# EAGLE design Adafruit nRF52840 Bluefruit Feather Express Rev E (EAGLE 9.6.2)
COMPANY: ADAFRUIT INDUSTRIES; DRAWN: KTOWN; REV: D; YEAR: 2018
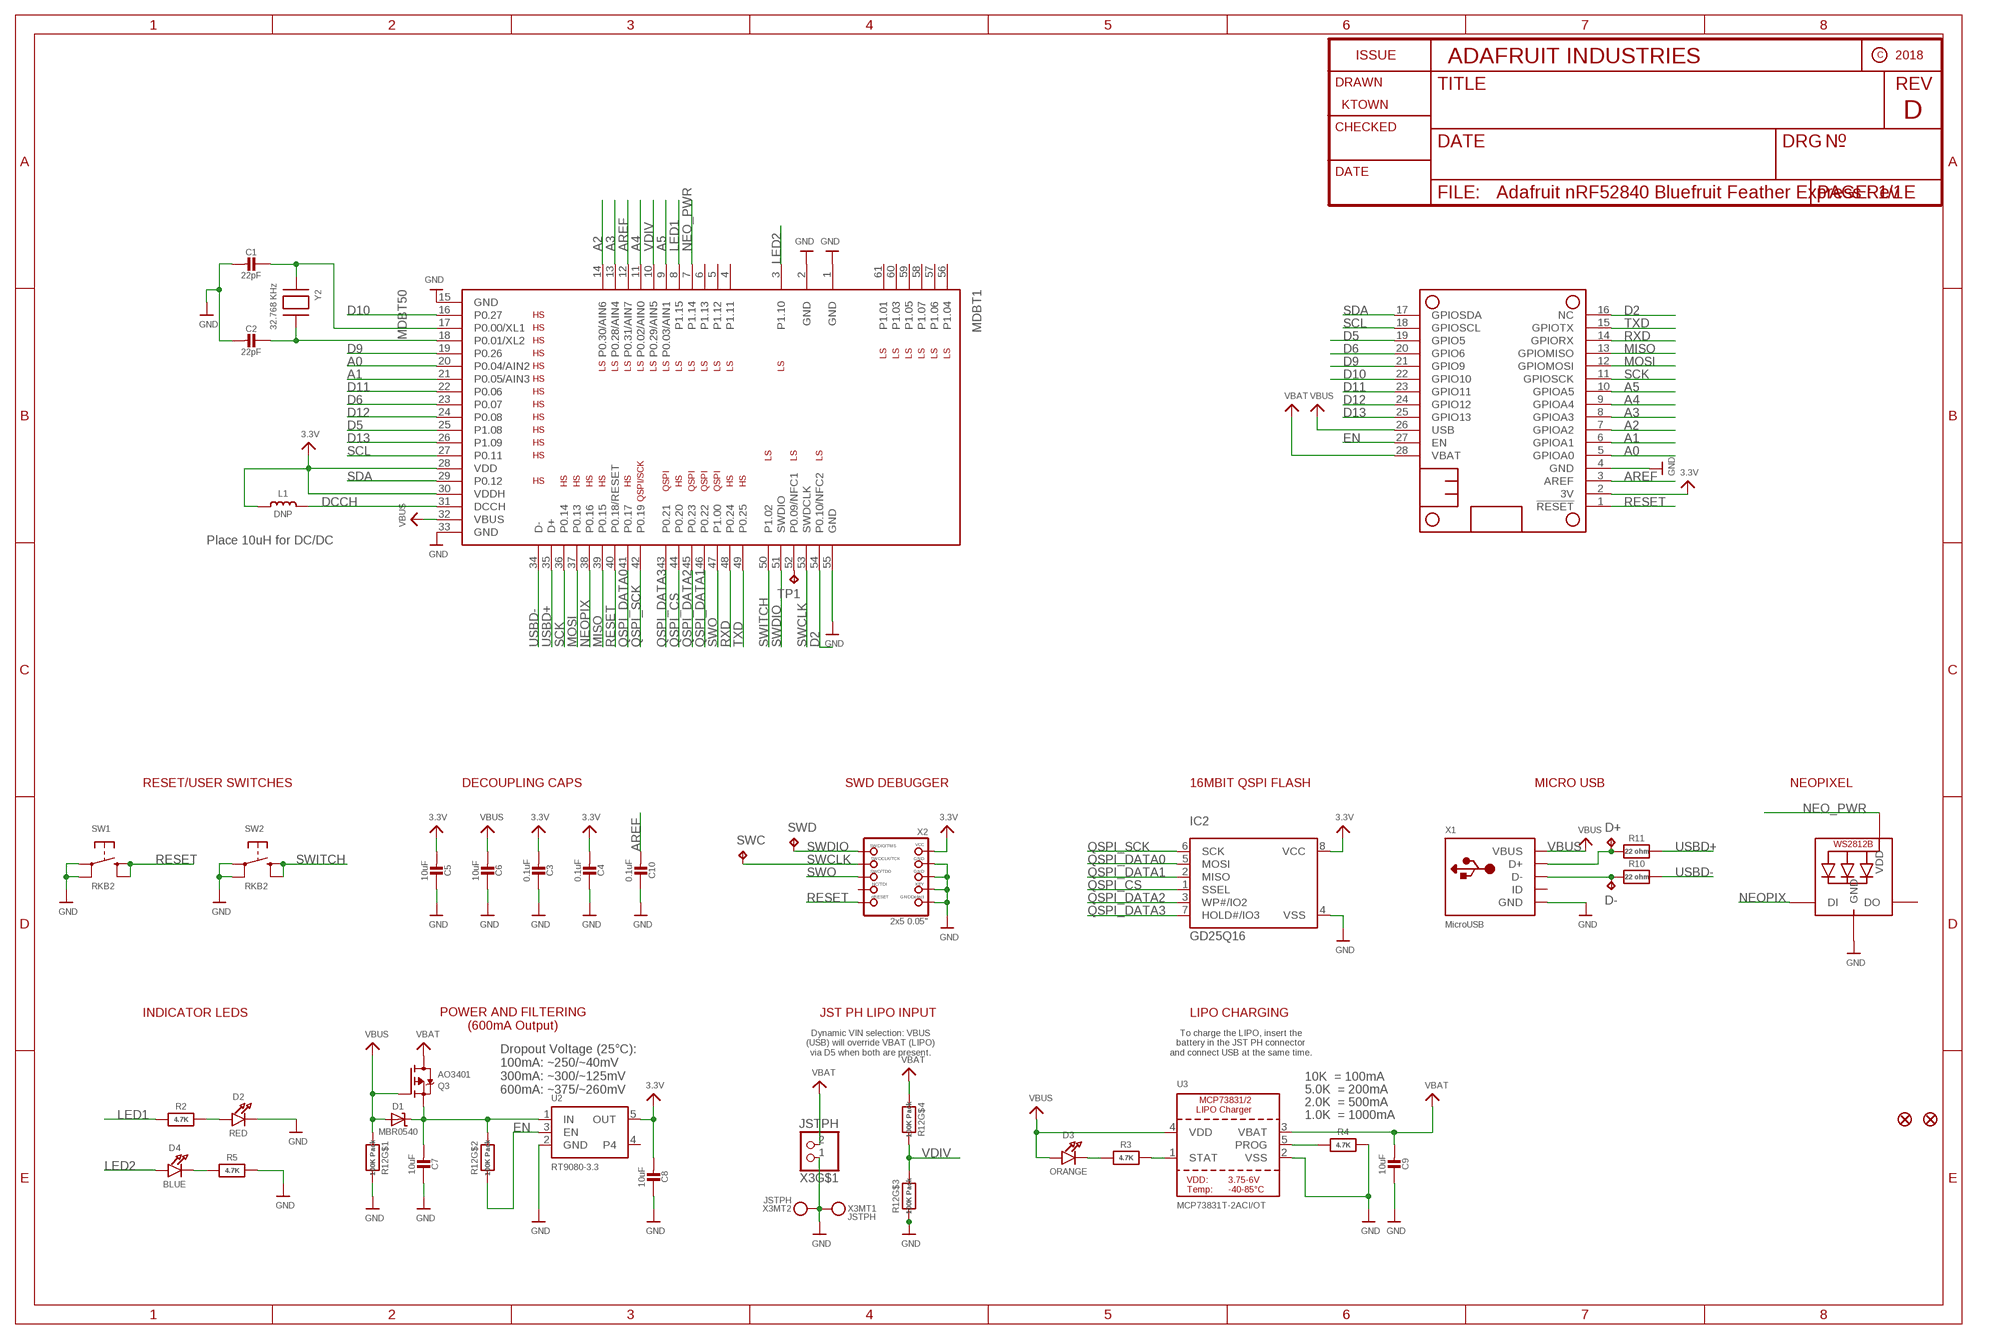
[diagram p0: schematic, sheet 1]

## Parts
C1  22pF  CAP_CERAMIC0603_NO  [0603-NO]
C2  22pF  CAP_CERAMIC0603_NO  [0603-NO]
C3  0.1uF  CAP_CERAMIC0603_NO  [0603-NO]
C4  0.1uF  CAP_CERAMIC0603_NO  [0603-NO]
C5  10uF  CAP_CERAMIC0805-NOOUTLINE  [0805-NO]
C6  10uF  CAP_CERAMIC0805-NOOUTLINE  [0805-NO]
C7  10uF  CAP_CERAMIC0805-NOOUTLINE  [0805-NO]
C8  10uF  CAP_CERAMIC0805-NOOUTLINE  [0805-NO]
C9  10uF  CAP_CERAMIC0805-NOOUTLINE  [0805-NO]
C10  0.1uF  CAP_CERAMIC0603_NO  [0603-NO]
D1  MBR0540  DIODE-SCHOTTKYSOD-123  [SOD-123]
D2  RED  LED0603_NOOUTLINE  [CHIPLED_0603_NOOUTLINE]
D3  ORANGE  LED0603_NOOUTLINE  [CHIPLED_0603_NOOUTLINE]
D4  BLUE  LED0603_NOOUTLINE  [CHIPLED_0603_NOOUTLINE]
D+  TPTP10R  [TP10R]
D-  TPTP10R  [TP10R]
FID1  FIDUCIAL_1MM  [FIDUCIAL_1MM]
FID2  FIDUCIAL_1MM  [FIDUCIAL_1MM]
IC2  GD25Q16  SPIFLASH_8PINUX  [USON8]
L1  DNP  INDUCTOR_0805MP  [_0805MP]
LED1  WS2812B_3535FULL  [LED3535_FULLPADS]
MDBT1  MDBT50  [MDBT50]
MS1  FEATHERWING_NODIM  [FEATHERWING_NODIM]
Q3  AO3401  MOSFET-P  [SOT23-R]
R2  4.7K  RESISTOR_0603_NOOUT  [0603-NO]
R3  4.7K  RESISTOR_0603_NOOUT  [0603-NO]
R4  4.7K  RESISTOR_0603_NOOUT  [0603-NO]
R5  4.7K  RESISTOR_0603_NOOUT  [0603-NO]
R10  22 ohm  RESISTOR_0603MP  [_0603MP]
R11  22 ohm  RESISTOR_0603MP  [_0603MP]
R12  100K Pack  RESISTOR_4PACK  [RESPACK_4X0603]
SW1  RKB2  SWITCH_TACT_SMT_RKB2  [BTN_RKB2_4.6X2.8]
SW2  RKB2  SWITCH_TACT_SMT_RKB2  [BTN_RKB2_4.6X2.8]
SWC  TPTP12R  [TP12R]
SWD  TPTP12R  [TP12R]
TP1  TPTP10R  [TP10R]
U2  RT9080-3.3  VREG_SOT23-5  [SOT23-5]
U3  MCP73831T-2ACI/OT  MCP73831/2  [SOT23-5]
X1  MicroUSB  USB_MICRO_20329_V2  [4UCONN_20329_V2]
X2  2x5 0.05"  JTAG-CORTEXBOXPOSTS  [2X05_1.27MM_BOX_POSTS]
X3  JSTPH  CON_JST_PH_2PIN_MT_BATT  [JSTPH2_BATT]
Y2  32.768 KHz  XTAL-3.2X1.5  [XTAL3215]

## Nets
3.3V [power]: C3.2 C4.2 C5.2 C8.2 IC2.8(VCC) L1.1 MDBT1.28(VDD) MDBT1.30(VDDH) MS1.2(3V) U2.5(OUT) X2.1(VCC)
A0: MDBT1.20(P0.04/AIN2) MS1.5(GPIOA0)
A1: MDBT1.21(P0.05/AIN3) MS1.6(GPIOA1)
A2: MDBT1.14(P0.30/AIN6) MS1.7(GPIOA2)
A3: MDBT1.13(P0.28/AIN4) MS1.8(GPIOA3)
A4: MDBT1.11(P0.02/AIN0) MS1.9(GPIOA4)
A5: MDBT1.9(P0.03/AIN1) MS1.10(GPIOA5)
AREF: C10.2 MDBT1.12(P0.31/AIN7) MS1.3(AREF)
D2: MDBT1.54(P0.10/NFC2) MS1.16(NC)
D5: MDBT1.25(P1.08) MS1.19(GPIO5)
D6: MDBT1.23(P0.07) MS1.20(GPIO6)
D9: MDBT1.19(P0.26) MS1.21(GPIO9)
D10: MDBT1.16(P0.27) MS1.22(GPIO10)
D11: MDBT1.22(P0.06) MS1.23(GPIO11)
D12: MDBT1.24(P0.08) MS1.24(GPIO12)
D13: MDBT1.26(P1.09) MS1.25(GPIO13)
D+: D+.TP R11.1 X1.D+
D-: D-.TP R10.1 X1.D-
DCCH: L1.2 MDBT1.31(DCCH)
EN: MS1.27(EN) R12.2 U2.3(EN)
GND: C1.2 C2.2 C3.1 C4.1 C5.1 C6.1 C7.1 C8.1 C9.1 C10.1 D2.C IC2.4(VSS) LED1.4(GND) MDBT1.1(GND) MDBT1.2(GND) MDBT1.15(GND) MDBT1.33(GND) MDBT1.55(GND) MS1.4(GND) R4.2 R5.2 R12.3 R12.8 SW1.A'(P1) SW1.A(P) SW2.A'(P1) SW2.A(P) U2.2(GND) U3.2(VSS) X1.BASE@1(GND) X1.BASE@2(GND) X1.GND X1.SPRT@1(GND) X1.SPRT@2(GND) X1.SPRT@3(GND) X1.SPRT@4(GND) X2.3(GND) X2.5(GND) X2.7(KEY) X2.9(GNDDETECT) X3.1 X3.NC1 X3.NC2
LED1: MDBT1.8(P1.15) R2.1
LED2: D4.A MDBT1.3(P1.10)
MISO: MDBT1.39(P0.15) MS1.13(GPIOMISO)
MOSI: MDBT1.37(P0.13) MS1.12(GPIOMOSI)
N$1: D3.C R3.1
N$5: D2.A R2.2
N$7: C1.1 MDBT1.17(P0.00/XL1) Y2.P$1
N$8: C2.1 MDBT1.18(P0.01/XL2) Y2.P$2
N$11: R3.2 U3.1(STAT)
N$12: R4.1 U3.5(PROG)
N$14: D4.C R5.1
NEO_PWR: LED1.2(VDD) MDBT1.7(P1.14)
NEOPIX: LED1.1(DI) MDBT1.38(P0.16)
NFC2: MDBT1.52(P0.09/NFC1) TP1.TP
QSPI_CS: IC2.1(SSEL) MDBT1.44(P0.20)
QSPI_DATA0: IC2.5(MOSI) MDBT1.41(P0.17)
QSPI_DATA1: IC2.2(MISO) MDBT1.46(P0.22)
QSPI_DATA2: IC2.3(WP#/IO2) MDBT1.45(P0.23)
QSPI_DATA3: IC2.7(HOLD#/IO3) MDBT1.43(P0.21)
QSPI_SCK: IC2.6(SCK) MDBT1.42(P0.19)
RESET: MDBT1.40(P0.18/RESET) MS1.1(!RESET) SW1.B'(S1) SW1.B(S) X2.10(NRESET)
RXD: MDBT1.48(P0.24) MS1.14(GPIORX)
SCK: MDBT1.36(P0.14) MS1.11(GPIOSCK)
SCL: MDBT1.27(P0.11) MS1.18(GPIOSCL)
SDA: MDBT1.29(P0.12) MS1.17(GPIOSDA)
SWCLK: MDBT1.53(SWDCLK) SWC.TP X2.4(SWDCLK)
SWDIO: MDBT1.51(SWDIO) SWD.TP X2.2(SWDIO)
SWITCH: MDBT1.50(P1.02) SW2.B'(S1) SW2.B(S)
SWO: MDBT1.47(P1.00) X2.6(SWO)
TXD: MDBT1.49(P0.25) MS1.15(GPIOTX)
USBD+: MDBT1.35(D+) R11.2
USBD-: MDBT1.34(D-) R10.2
VBAT [power]: C9.2 MS1.28(VBAT) Q3.3(D) R12.4 U3.3(VBAT) X3.2
VBUS [power]: C6.2 D1.A D3.A MDBT1.32(VBUS) MS1.26(USB) Q3.1(G) R12.1 U3.4(VDD) X1.VBUS
VDIV: MDBT1.10(P0.29/AIN5) R12.5 R12.6
VHI [power]: C7.2 D1.C Q3.2(S) R12.7 U2.1(IN)
Unconnected: LED1.3(DO) MDBT1.4(P1.11) MDBT1.5(P1.12) MDBT1.6(P1.13) MDBT1.56(P1.04) MDBT1.57(P1.06) MDBT1.58(P1.07) MDBT1.59(P1.05) MDBT1.60(P1.03) MDBT1.61(P1.01) U2.4 X1.ID X2.8(TDI)

## Notes on the sheet
- Place 10uH for DC/DC
- RESET/USER SWITCHES | DECOUPLING CAPS | SWD DEBUGGER | 16MBIT QSPI FLASH | MICRO USB | NEOPIXEL
- INDICATOR LEDS | JST PH LIPO INPUT | LIPO CHARGING
- POWER AND FILTERING
  (600mA Output)
- Dynamic VIN selection: VBUS
  (USB) will override VBAT (LIPO)
  via D5 when both are present.
- To charge the LIPO, insert the
  battery in the JST PH connector
  and connect USB at the same time.
- 10K  = 100mA
- Dropout Voltage (25°C):
  100mA: ~250/~40mV
  300mA: ~300/~125mV
  600mA: ~375/~260mV
- 5.0K  = 200mA
- 2.0K  = 500mA
- 1.0K  = 1000mA

## Library data of the parts
C1-C10 = microbuilder:CAP_CERAMIC: Ceramic Capacitors For new designs, use the packages preceded by an '_' character since they are more reliable: The following footprints should be used on most boards: _0402 - Standard footprint for regular board layouts _0603 - Standard footprint for regular board layouts _0805 - Standard footprint for regular board layouts _1206 - Standard footprint for regular board layouts For extremely tight-pitch boards where space is at a premium, the following 'micro-pitch' footprints can be used (smaller pads, no silkscreen outline, etc.): _0402MP - Micro-pitch footprint for very dense/compact boards _0603MP - Micro-pitch footprint for very dense/compact boards _0805MP - Micro-pitch footprint for very dense/compact boards _1206MP - Micro-pitch footprint for very dense/compact boards
D1 = microbuilder:DIODE-SCHOTTKY
D2-D4 = microbuilder:LED: LED 0603 - 0603 Surface Mount Package 2mA: Green LED - Low Power (3.9mcd, 2ma, 1.7Vf) - Digikey: 475-2709-2-ND Orange LED - Low Power (9.8mcd, 2ma, 1.8Vf) - Digikey: 475-1194-2-ND Red LED - Low Power (5mcd, 2ma, 1.8Vf) - Digikey: 475-1195-2-ND Yellow LED - Low Power (7mcd, 2ma, 1.8Vf) - Digikey: 475-1196-2-ND 5mA: Blue LED - Low Power (17mcd, 5ma, 2.9Vf) - Digikey: LNJ937W8CRACT-ND 0805 - 0805 Surface Mount Package 2mA: Red LED (8.8mcd, 2mA, 1.8Vf, Clear) - Low Power [Digikey: 475-2510-1-ND] Green LED (5mcd, 2mA, 1.8Vf, Clear) - Low Power [Digikey: 475-2730-1-ND] Yellow LED (11.3mcd, 2mA, 1.8Vf, Clear) - Low Power [Digikey: 475-2555-1-ND] 20mA: Red LED (104mcd, 20mA, Diffused) - LS R976 [Digikey: 475-1278-6-ND] Red LED (12mcd, 20mA, 2.0Vf, Clear) - APT2012EC [Digikey: 754-1128-1-ND] Green LED (15mcd, 20mA, 2.2Vf, Clear) - APT2012GC [Digikey: 754-1131-1-ND] Orange LED (160mcd, 20mA, 2.1Vf, Clear) - APT2012SECK [Digikey: 754-1130-1-ND] 1206 - 1206 Surface Mount Package Green LED (26mcd, 20mA, Diffused) - LG N971 [Digikey: 475-1407-6-ND] Red LED (15mcd, 20mA, Diffused) - LH N974 [Digikey: 475-1416-6-ND] Cree - Cree High-Power Surface Mount LEDs XPEBWT-L1-0000-00D50 - White 111lm 350mA 2.9Vf 6200K 110° XTEAWT-00-0000-00000LEE3 - White 114lm 350mA 2.85Vf 5000K 115° Everlight - Everlight 45-21 Series Surface Mount LEDs 45-21/QK2C-B2832AC2CB2/2T - Warm White 2000mcd 20mA 3.25Vf 3050K 120° 45-21/LK2C-B38452C4CB2/2T - Nuetral White 2000mcd 20mA 3.25Vf 4150K 120° 45-21/LK2C-B50634C6CB2/2T - Cold White 2200mcd 20mA 3.25Vf 5650K 120° PLCC2 Reverse Mount LS T77K-J1L2-1-0-2-R18-Z - Red 11.25mcd 2mA 1.8Vf 630nm 120° LO T77K-L1M2-24-Z - Orange 19.6mcd 2mA 1.8Vf 606nm 120° LY T77K-K2M1-26-Z - Yellow 15.7mcd 2mA 1.8Vf 587nm 120°; ROT: 270
D+ D- SWC SWD TP1 = testpad:TP: Test pad
FID1 FID2 = microbuilder:FIDUCIAL: Fiducial Alignment Points Various fiducial points for machine vision alignment.; BOM: EXCLUDE
IC2 = microbuilder:SPIFLASH_8PIN: SOIC8 SPI Flash Be careful with the size since SOIC8 flash comes in several 'widths' SOIC8 150 mil M25P16 - 16Mbit (2Mbit x 8) Serial Flash (75MHz SPI Bus), Supply: 2.7-3.6V Digikey: SOIC8 - M25P16-VMN6P-ND SOIC8 208 mil W25Q16BVSSIG - 16Mbit (2Mbit x 8) Serial Flash (104MHz SPI Bus), Supply: 2.7-3.6V Digikey: SOIC8 - W25Q16BVSSIG-ND
L1 = microbuilder:INDUCTOR: Inductors 0603: 10nH Ceramic Inductor - microwire antenna/RF (Digikey: 712-1434-2-ND) 0805: 560nH Ceramic Inductor - RF (Digikey: 553-1047-1-ND) 270nH Ceramic Inductor - Q = 40@250MHz, +-5%, 1 Ohm DC Resistance (Digikey: 535-10506-2-ND) 1007 (2518 Metric) SMT: 10µH 10% 250mOhm 820mA 1007 Inductor (Digikey: 587-2189-1-ND) 22µH 10% 500mOhm 580mA 1007 Inductor (Digikey: 587-2190-1-ND) 47µH 10% 950mOhm 420mA 1007 Inductor (Digikey: 587-2191-1-ND) 47µH 5% 100mOhm 1A 1008 Inductor (Digikey: 732-1816-1-ND) 5.0x5.0mm (Taiyo Yuden NR5040 Series) 6.8µH 20% 2.3A 64mOhm Inductor (Digikey: 587-2374-2-ND) 5.0x5.0mm (TDK VLC5045 Series) 4.7µH 20% 3.3A 34mOhm Inductor (Digikey: 445-6526-1-ND) 6.8µH 20% 2.7A 46mOhm Inductor (Digikey: 445-6527-1-ND) 6.0x6.0mm (TDK VLC6045 Series) 4.7µH 20% 3.8A 27mOhm Inductor (Digikey: 445-6538-2-ND) 6.8µH 20% 3A 41mOhm Inductor (Digikey: 445-6540-1-ND) 6.2µH 30% 2.2A 45mOhm Inductor (Digikey: SRR5028-6R2YCT-ND) - Not TDK VLC6045 but footprint should match 6.0x6.0mm (TDK SLF6045 Series) 6.8uH 30% 2A 33mOhm Inductor (Digikey: 445-4572-1-ND, Mouser: 810-SLF645T6R8N2R0PF) 6.0x6.0mm (Sumida CDRH5D28 Series) 6.2uH 30% 1.8A 45mOhm Inductor (Digikey: 308-1542-1-ND) Taiyo Yuden NR3015T2R2M - 2.2uH 20% 1.5A (Digikey: 587-1648-2-ND, Mouser: 963-NR3015T2R2M) - Used with TI TPS62172 CoilCraft RFID Transponder Coil - MA5532-AE (For use with AS3935 Lightning Sensor) Taiyo Yuden NRH2412T2R2MNGH - 2.2uH 20% 1AA (Digikey: 587-3443-1-ND) - Used with TI LM3671 Vishay IHLP 1.0uH Molded Inductor - 24mOhm DCR, 5A, +/-20%, -55°C-125°C (Digikey: 541-1319-1-ND)
LED1 = microbuilder:WS2812B; ROT: 180
MDBT1 = microbuilder:MDBT50: Raytac Corporation MDBT50 Bluetooth Low Energy Module based on Noridc nRF52840 Source: Raytac datasheet
MS1 = microbuilder:FEATHERWING
Q3 = microbuilder:MOSFET-P: P-Channel Mosfet LEGEND VDS: Voltage Drain-Source ID: Drain Current RDS(ON): Drain-Source On-State Resistance VGS(TH): Gate-Source Threshold Voltage CISS: Drain-Source Input Capacitance SOT-23 Name VDS ID RDS(ON) VGS(TH) CISS Order Number IRLML5103 30V 760mA 600 mOhm -- 75pF @ 25V Digikey: IRLML5103PBFCT-ND IRLML6401 12V 4.3A 50 mOhm 950mV @ 250µA 830pF @ 10V Digikey: IRLML6401PBFTR-ND NTR0202PL 20V 400mA 800 mOhm 2.3V @ 250uA 70pF @ 5V Digikey: NTR0202PLT1GOSTR-ND NTR4101PT1G 20V 1.8A 85 mOhm 1.2V @ 250uA 675pF @ 10V Digikey: NTR4101PT1GOSCT-ND DMP2004K 20V 600mA 900 mOhm 1V @ 250uA 175pF @ 16V Digikey: DMP2004KDICT-ND PMV65XP 20V 3.9A 76 mOhm 950mV @ 1mA 725pF @ 20V Digikey: 568-2358-2-ND TO-252 Name VDS ID RDS(ON) VGS(TH) CISS Order Number AOD417 30V 25A 34 mOhm 3V @ 250µA 920pF @ 15V Digikey: 785-1106-2-ND PowerPak Name VDS ID RDS(ON) VGS(TH) CISS Order Number AON7401 30V 12A 14 mOhm 3V @ 250µA 2600pF @ 15V Digikey: 785-1302-1-ND
R2-R5 R10 R11 = microbuilder:RESISTOR: Resistors For new designs, use the packages preceded by an '_' character since they are more reliable: The following footprints should be used on most boards: _0402 - Standard footprint for regular board layouts _0603 - Standard footprint for regular board layouts _0805 - Standard footprint for regular board layouts _1206 - Standard footprint for regular board layouts For extremely tight-pitch boards where space is at a premium, the following 'micro-pitch' footprints can be used (smaller pads, no silkscreen outline, etc.): _0402MP - Micro-pitch footprint for very dense/compact boards _0603MP - Micro-pitch footprint for very dense/compact boards _0805MP - Micro-pitch footprint for very dense/compact boards _1206MP - Micro-pitch footprint for very dense/compact boards
R12 = microbuilder:RESISTOR_4PACK: Resistor Packs (4 resistors) 4 x 0603 10K 1/16W - Digikey: YC164J-10KCT-ND
SW1 SW2 = adafruit_electromech:SWITCH_TACT_SMT: SMT Tact Switches RKB2 https://www.digikey.com/short/m027prz5
U2 = adafruit_power:VREG_SOT23-5: SOT23-5 Fixed Voltage Regulators Part Current Out V Out V In V Dropout θJA (°C/W) TJ (°C) Digikey Part No. ADP121 150mA 3.3V 3.4-5.5V 0.09V @ 150mA -- -- ADP121-AUJZ33R7CT-ND ADP121 150mA 3.0V 3.1-5.5V 0.09V @ 150mA -- -- ADP121-AUJZ30R7CT-ND ADP122 300mA 3.3V 3.4-5.5V 0.085V @ 300mA -- -- ADP122AUJZ-3.3-R7CT-ND ADP1712 300mA 3.3V 3.5-5.5V 0.17V @ 300mA -- -- ADP1712AUJZ-3.3-R7TR-ND AP7311 (Low Cost) 150mA 3.3V 3.5-6V 0.15V @ 150mA -- -- AP7311-33WG-7DICT-ND LD39015M18R 150mA 1.8V 1.9V-5.5V 0.08V @ 100mA -- -- 497-6977-1-ND LP2985A-33DBVR 150mA 3.3V 3.3-16V 0.28V @ 150mA 206 150 296-18479-1-ND MCP1824T-3302E/OT 300mA 3.3V 3.5V-6V 0.2V @ 300mA -- -- MCP1824T-3302E/OTCT-ND MIC5205-2.5YM5 TR 150mA 2.5V 2.7-16V 0.165V @ 150mA -- -- 576-1257-2-ND MIC5205-3.0YM5 TR 150mA 3.0V 3.2V-16V 0.165V @ 150mA -- -- 576-1258-2-ND MIC5205-3.3YM5 TR 150mA 3.3V 3.5V-16V 0.165V @ 150mA -- -- 576-1259-2-ND TPS780330220 150mA 3.3V+2.2V 3.6-5.5V 250mV Max -- -- 296-23332-1-ND TDA3663/N1,135 100mA 3.3V 3.5-45V 0.18V @ 50mA -- -- 568-5343-1-ND Max operating temp can be calculated using θJA, TJ (max junction temperature), and power in watts. Set the "Maximum Ambient Temperature" until it reaches TJ ("Max Junction Temperature"), which is the absolute limit for safe use of the regulator: Heat Sink Temperature Calculator <http://www.daycounter.com/Calculators/Heat-Sink-Temperature-Calculator.phtml> For example, With 12V source into a 3.3V LP2985 and a 30mA load, we are dissipating (12V-3.3V) * 0.03A = 0.261W. With a θJA of 206 °C/W, a TJ of 150°C, and 261mW we can safely use the chip without a heat sink up to 75°C (=147.1°C Junction Temperature).; JLC_ROTATION: 0
U3 = microbuilder:MCP73831/2: MCP73831/2 LIPO Charger VDD: 3.75 - 6V Temp -40 - 85°C Programmable Charge Rate: 15-500mA NOTE: STAT is a tri-state logic output on the MCP73831 and an open-drain output on the MCP73832. SOT23-5 with 4.2V output and tri-state logic on STAT = MCP73831T-2ACI/OT; JLC_ROTATION: 0; LCSC: C424093
X1 = adafruit_electromech:USB: USB Connectors USBMINIB - Surface Mount Female Mini-B USB Connector 4UConnector: 06564
X2 = adafruit_electromech:JTAG-CORTEX: Serial Wire (SW-DP) Connector Standard 0.05" 10-pin connector is for use with the Cortex M and Cortex A SWD (serial wire debugger) interface (SW-DP) Connectors 2x05_1.27MM_SMT - Inexpensive surface-mount header with bare pins, compatible with standard 10-pin SWD cables (4UCON: 16846) 2x05_1.27MM_BOX_NOPOSTS - Polarised surface-mount box (4UCON with caps: 19735, without caps: 15117 2x05_1.27MM_BOX_POSTS - Polarised surface-mount box with mounting holes (4UCON: 20317) Pinout: http://infocenter.arm.com/help/topic/com.arm.doc.faqs/attached/13634/cortex_debug_connectors.pdf http://www.keil.com/peripherals/coresight/connectors.asp
X3 = adafruit_electromech:CON_JST_PH_2PIN_MT; LCSC: C47647
Y2 = adafruit2:XTAL: Low cost SMT crystals, no capacitors included http://www.ladyada.net/library/eagle

## Net classes
1 power: width 0.254 mm

## Board
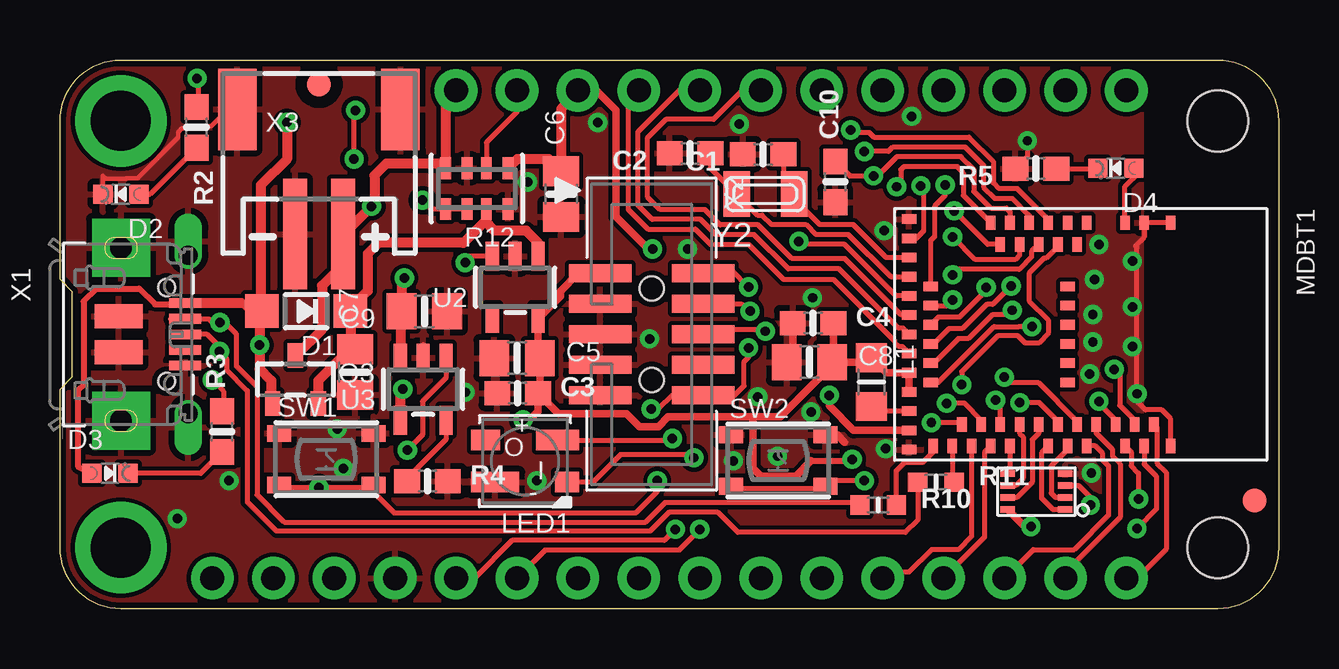
[diagram p1: board, top side]
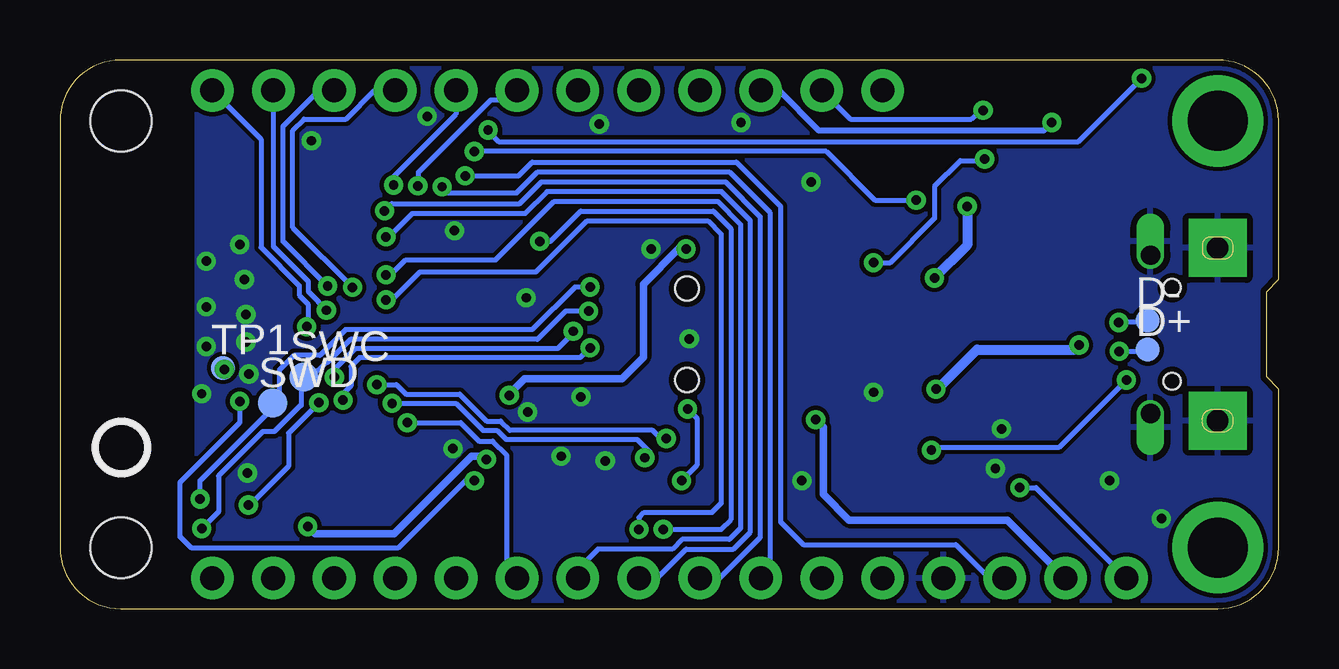
[diagram p2: board, bottom side, seen from below]

Size 50.8 x 22.86 mm. Coordinates in mm from the lower left corner, seen from the top.
Outline: 2.54,22.86 48.26,22.86 arc-90 50.8,20.32 50.8,2.54 arc-90 48.26,0 2.54,0 arc-90 0,2.54 0,9.14 0.51,9.65 0.51,13.21 0,13.72 0,20.32 arc-90 2.54,22.86
Copper layers (1*16): Top 0.035mm / dielectric 1.5mm / Bottom 0.035mm
Design rules "adafruit 7-7": minimum track width 7mil, minimum drill 15.5mil, track to track 7mil, track to pad 7mil, pad to pad 7mil, via to via 7mil, smd to smd 7mil, copper to edge 10mil, drill to drill 8mil, minimum pad ring 7mil, minimum via ring 8mil, stop-mask expansion 2mil, vias tented up to drill 20mil, thermal gap 10mil

### Footprints (pad centres in the part's own frame; a part is rotated, then mirrored left to right if it is on the bottom)
0603-NO = smd 1.075 x 1: 1 -0.85,0; 2 0.85,0
0805-NO = smd 1.24 x 1.5: 1 -0.95,0; 2 0.95,0
SOD-123 = smd 1.4 x 1.4: A 1.85,0; C -1.85,0
CHIPLED_0603_NOOUTLINE = smd 0.8 x 0.8: A 0,-0.75; C 0,0.75
TP10R = smd 1 x 1: TP 0,0
FIDUCIAL_1MM = smd 1 x 1: 1 0,0
USON8 = smd 0.6 x 0.275: 1 -1.2,0.75; 2 -1.2,0.25; 3 -1.2,-0.25; 4 -1.2,-0.75; 5 1.2,-0.75; 6 1.2,-0.25; 7 1.2,0.25; 8 1.2,0.75
_0805MP = smd 1.2 x 1.3: 1 -1.016,0; 2 1.016,0
LED3535_FULLPADS = smd 1 x 0.85: 1 -1.75,0.875 | smd 1.8 x 0.85: 2 -1.35,-0.875 | smd 1.2 x 0.85: 3 1.65,-0.875 | smd 2 x 0.85: 4 1.25,0.875
MDBT50 = smd 0.6 x 0.4: 1 -4.65,3.75; 2 -4.65,2.65; 3 -4.65,1.85; 4 -4.65,0.25; 5 -3.75,-0.15; 6 -4.65,-0.55; 7 -3.75,-0.95; 8 -4.65,-1.35; 9 -3.75,-1.75; 10 -4.65,-2.15; 11 -3.75,-2.55; 12 -4.65,-2.95; 13 -3.75,-3.35; 14 -4.65,-3.75; 34 4.65,-6.15; 35 4.65,-5.35; 36 3.75,-4.95; 37 4.65,-4.55; 38 3.75,-4.15; 39 4.65,-3.75; 40 3.75,-3.35; 41 4.65,-2.95; 42 3.75,-2.55; 43 3.75,-1.75; 44 4.65,-1.35; 45 3.75,-0.95; 46 4.65,-0.55; 47 3.75,-0.15; 48 4.65,0.25; 49 3.75,0.65; 50 3.75,1.45; 51 4.65,1.85; 52 3.75,2.25; 53 4.65,2.65; 54 3.75,3.05; 55 4.65,3.75 | smd 0.4 x 0.6: 15 -4.8,-7.15; 16 -4,-7.15; 17 -3.2,-7.15; 18 -2.4,-7.15; 19 -2,-6.25; 20 -1.6,-7.15; 21 -1.2,-6.25; 22 -0.8,-7.15; 23 -0.4,-6.25; 24 0,-7.15; 25 0.4,-6.25; 26 0.8,-7.15; 27 1.2,-6.25; 28 1.6,-7.15; 29 2,-6.25; 30 2.4,-7.15; 31 3.2,-7.15; 32 4,-7.15; 33 4.8,-7.15; 56 -2,-0.55; 57 -1.2,-0.55; 58 -0.4,-0.55; 59 0.4,-0.55; 60 1.2,-0.55; 61 2,-0.55
FEATHERWING_NODIM = drill 1 pad 1.778: 1 6.35,1.27; 2 8.89,1.27; 3 11.43,1.27; 4 13.97,1.27; 5 16.51,1.27; 6 19.05,1.27; 7 21.59,1.27; 8 24.13,1.27; 9 26.67,1.27; 10 29.21,1.27; 11 31.75,1.27; 12 34.29,1.27; 13 36.83,1.27; 14 39.37,1.27; 15 41.91,1.27; 16 44.45,1.27; 17 44.45,21.59; 18 41.91,21.59; 19 39.37,21.59; 20 36.83,21.59; 21 34.29,21.59; 22 31.75,21.59; 23 29.21,21.59; 24 26.67,21.59; 25 24.13,21.59; 26 21.59,21.59; 27 19.05,21.59; 28 16.51,21.59 | drill 2.5 pad 3.81: P$1 2.54,20.32; P$2 2.54,2.54 | hole 2.54: 48.26,20.32; 48.26,2.54
SOT23-R = smd 0.635 x 1.016: 1 -0.95,-1; 2 0.95,-1; 3 0,1
_0603MP = smd 0.8 x 0.8: 1 -0.762,0; 2 0.762,0
RESPACK_4X0603 = smd 0.45 x 0.9: 1 -1.3,-0.85; 2 -0.4,-0.85; 3 0.4,-0.85; 4 1.3,-0.85; 5 1.3,0.85; 6 0.4,0.85; 7 -0.4,0.85; 8 -1.3,0.85
BTN_RKB2_4.6X2.8 = smd 1 x 0.7: A 1.973,1.075; A' -1.973,1.075; B 1.973,-1.075; B' -1.973,-1.075
TP12R = smd 1.2 x 1.2: TP 0,0
SOT23-5 = smd 0.55 x 1.2: 1 -0.95,-1.3; 2 0,-1.3; 3 0.95,-1.3; 4 0.95,1.3; 5 -0.95,1.3
4UCONN_20329_V2 = smd 1 x 2: BASE@1 -0.75,-1.365; BASE@2 0.75,-1.365 | smd 0.4 x 1.35: D+ 0,1.41; D- -0.65,1.41; GND 1.3,1.41; ID 0.65,1.41; VBUS -1.3,1.41 | drill 0.8 pad 1.143 offset: SPRT@1 -3.3,1.535; SPRT@2 3.3,1.535 | drill 0.9 pad 2.413 square: SPRT@3 -3.6,-1.265; SPRT@4 3.6,-1.265 | hole 0.7: -1.95,0.635; 1.95,0.635
2X05_1.27MM_BOX_POSTS = smd 0.76 x 2.6: 1 -2.54,-2.15; 2 -2.54,2.15; 3 -1.27,-2.15; 4 -1.27,2.15; 5 0,-2.15; 6 0,2.15; 7 1.27,-2.15; 8 1.27,2.15; 9 2.54,-2.15; 10 2.54,2.15 | hole 1: -1.905,0; 1.905,0
JSTPH2_BATT = smd 1 x 4.6: 1 -1,-2.303; 2 1,-2.303 | smd 1.6 x 3.4: NC1 -3.4,2.897; NC2 3.4,2.897
XTAL3215 = smd 1.1 x 1.9: P$1 1.2,0; P$2 -1.2,0

### Placement (x,y rotation side)
C1  29.31,18.94 180 top
C2  26.26,18.97 180 top
C3  19.08,8.98 0 top
C4  31.39,11.9 0 top
C5  19.05,10.44 0 top
C6  20.89,17.27 90 top
C7  12.29,9.86 90 top
C8  31.24,10.27 0 top
C9  15.19,12.38 180 top
C10  32.32,17.78 90 top
D1  10.26,12.4 180 top
D2  2.54,17.27 90 top
D3  2.08,5.64 270 top
D4  44.01,18.35 90 top
D+  5.46,10.79 0 bottom
D-  5.46,12 0 bottom
FID1  10.79,21.84 0 top
FID2  49.78,4.51 0 top
IC2  40.7,4.88 180 top
L1  33.82,9.44 270 top
LED1  19.39,6.15 180 top
MDBT1  42.55,11.43 270 top
MS1  0,0 0 top
Q3  9.82,9.55 0 top
R2  5.69,20.05 270 top
R3  6.76,7.38 90 top
R4  15.32,5.31 0 top
R5  40.68,18.34 180 top
R10  34.1,4.32 0 top
R11  36.51,5.27 0 top
R12  17.37,17.5 180 top
SW1  11.1,6.22 0 top
SW2  29.93,6.17 0 top
SWC  40.63,9.65 0 bottom
SWD  41.94,8.56 0 bottom
TP1  44.01,10.03 0 bottom
U2  18.97,13.39 180 top
U3  15.14,9.14 180 top
U$10  [PCBFEAT-REV-056]  48.24,6.72 0 bottom
U$12  [NRF52840_BOT]  50.8,0 0 bottom
U$14  [NRF52840_TOP]  0,0 0 top
X1  3.81,11.43 270 top
X2  24.66,11.43 270 top
X3  10.79,17.91 0 top
Y2  29.4,17.27 0 top

### Tracks (layer width: path | path; a pad name or v marks a point on that pad's centre or on a via)
3.3V  (via drill 0.39)
  Top 0.254: 31.31,6.16 32.96,6.16 v33.02,6.22
  Top 0.305: 20.24,10.68 19.92,11 U2.5 20.86,13.02 20.86,13.23 21.6,13.97 X2.1 | MDBT1.30 MDBT1.28 34.44,9.83 L1.1 33.64,10.27 C8.2 | C8.2 32.24,10.33 C4.2 | C8.2 32.19,10.16 30.04,8 28.89,8 | 31.31,6.16 30.67,5.52 29.21,5.52 28.89,5.84 28.89,8 | IC2.8 40.21,3.42 v40.47,3.42 | C5.2 20,9.05 C3.2 | C3.2 20.78,8.13 23.62,8.13 24.16,7.59 24.94,7.59 25.35,8 28.89,8 | C3.2 19.93,8.22 19.58,7.87 v19.3,7.87
  Top 0.406: 20.24,10.68 C5.2
  Bottom 0.305: v40.47,3.42 40.16,3.11 36.87,3.11 33.63,6.35 33.15,6.35 v33.02,6.22 | MS1.2 11.3,3.68 17.91,3.68 18.99,4.76 18.99,7.56 v19.3,7.87
A0  (via drill 0.39)
  Top 0.203: MDBT1.20 34.85,13.03 32.71,15.18 30.92,15.18 v30.8,15.3 | v25.65,3.3 25.2,2.85 18.85,2.85 17.27,1.27 MS1.5
  Bottom 0.203: v30.8,15.3 30.35,15.3 29.1,16.56 23.56,16.56 22.84,15.84 22.84,3.71 23.24,3.3 v25.65,3.3
A1  (via drill 0.39)
  Top 0.203: MDBT1.21 36.98,12.63 v37.21,12.87 | MS1.6 20.22,2.44 25.81,2.44 v26.67,3.3
  Bottom 0.203: v26.67,3.3 26.67,3.79 26.45,4.01 23.62,4.01 23.24,4.38 23.24,15.6 23.79,16.15 28.83,16.15 30.96,14.03 35.8,14.03 36.96,12.87 v37.21,12.87
A2  (via drill 0.39)
  Top 0.203: v34.87,17.58 35.05,17.76 35.05,18.29 35.19,18.43 37.39,18.43 37.66,18.16 37.66,17.22 MDBT1.14
  Bottom 0.203: v34.87,17.58 34.62,17.32 31.76,17.32 30.89,18.2 22.9,18.2 21.21,16.51 21.21,1.65 MS1.7
A3  (via drill 0.39)
  Top 0.203: MDBT1.13 38.67,15.18 v37.27,16.57
  Bottom 0.203: v37.27,16.57 36.97,16.87 31.64,16.87 30.73,17.78 23.06,17.78 21.61,16.34 21.61,2.96 23.3,1.27 MS1.8
A4  (via drill 0.39)
  Top 0.203: MDBT1.11 39.99,14.72 39.81,14.54 38.16,14.54 v37.21,15.49
  Bottom 0.203: v37.21,15.49 37.08,15.49 36.11,16.47 31.41,16.47 30.5,17.37 23.23,17.37 22.02,16.17 22.02,3.19 22.73,2.48 24.7,2.48 25.91,1.27 MS1.9
A5  (via drill 0.39)
  Top 0.203: MDBT1.9 40.5,14.88 40.5,14.65 39.98,14.13 37.44,14.13 v37.21,13.91
  Bottom 0.203: v37.21,13.91 37.02,13.91 36.39,14.54 32.63,14.54 30.2,16.97 23.39,16.97 22.43,16 22.43,3.36 22.9,2.88 24.87,2.88 25.27,2.48 28.38,2.48 29.21,1.65 MS1.10
AREF  (via drill 0.39)
  Top 0.203: C10.2 32.92,18.03 v33.91,18.03 34.09,18.03 34.9,18.83 37.56,18.83 38.09,18.3 38.09,17.39 38.8,16.68 39.45,16.68 39.59,16.54 MDBT1.12
  Bottom 0.203: v33.91,18.03 31.69,18.03 31.11,18.61 22.61,18.61 20.77,16.76 20.77,3.62 19.81,2.67 13.46,2.67 12.06,1.27 MS1.3
D2
  Top 0.203: MDBT1.54 45.72,7.55 45.72,6.07 46.11,5.68 46.11,2.48 44.9,1.27 MS1.16
D5  (via drill 0.39)
  Top 0.203: MDBT1.25 36.42,11.03 37.06,11.66 37.61,11.66 38.63,12.68 38.88,12.68 v39.64,13.44
  Bottom 0.203: v39.64,13.44 41.5,15.3 41.5,20.09 40.01,21.59 MS1.19
D6  (via drill 0.39)
  Top 0.203: MDBT1.23 36.61,12.15 37.5,12.15 38.61,13.26 v38.61,13.39
  Bottom 0.203: v38.61,13.39 41.1,15.88 41.1,19.92 40.62,20.4 38.88,20.4 37.68,21.59 MS1.20
D9  (via drill 0.39)
  Top 0.203: MDBT1.19 36.3,15.34 36.45,15.49 36.45,16.76 36.89,17.21 v36.89,17.65
  Bottom 0.203: MS1.21 34.29,20.6 36.89,18 v36.89,17.65
D10  (via drill 0.39)
  Top 0.203: MDBT1.16 35.7,15.43 36,15.72 36,17.5 v35.88,17.61
  Bottom 0.203: v35.88,17.61 35.86,17.63 35.86,18.17 32.84,21.2 32.14,21.2 MS1.22
D11
  Top 0.203: MDBT1.22 35.08,12.23 32.73,14.58 30.51,14.58 29.1,15.99 27.51,15.99 26.88,16.62 25.02,16.62 24.5,17.14 24.5,19.62 25.26,20.38 27.24,20.38 28.45,21.59 MS1.23
D12
  Top 0.203: MDBT1.24 35.14,11.68 34.95,11.68 32.47,14.16 30.36,14.16 28.93,15.58 27.34,15.58 26.71,16.22 24.68,16.22 24.09,16.8 24.09,19.86 25.82,21.59 MS1.24
D13
  Top 0.203: MS1.25 23.69,21.14 23.69,16.64 24.51,15.81 26.48,15.81 27.11,15.18 28.7,15.18 30.16,13.72 32.24,13.72 34.79,11.17 34.79,11.1 34.97,10.93 35.1,10.93 MDBT1.26
D+  (via drill 0.39)
  Top 0.203: X1.D+ 6.13,11.43 6.76,10.8 6.76,10.61 | v6.65,10.72 6.76,10.61 | 6.76,10.61 6.95,10.42 6.95,9.94 7.81,9.08 7.81,4.45 9.03,3.23 24.6,3.23 25.38,4.01 27.43,4.01 28.26,3.17 35.24,3.17 35.75,3.68 R11.1
  Bottom 0.203: v6.65,10.72 5.54,10.72 D+.TP
D-  (via drill 0.39)
  Top 0.203: X1.D- 4.6,12.06 6.21,12.06 6.34,11.94 | 6.34,11.94 6.86,11.94 7.35,11.45 7.35,10.11 8.22,9.25 8.22,4.74 9.35,3.61 24.41,3.61 25.22,4.41 33.21,4.41 R10.1 | v6.67,11.92 6.35,11.92 6.34,11.94
  Bottom 0.203: D-.TP 5.54,11.92 v6.67,11.92
DCCH
  Top 0.203: MDBT1.31 34.01,8.23 L1.2
EN  (via drill 0.39)
  Top 0.203: MS1.27 19.05,20.7 17.77,19.43 R12.2 | U2.3 16.89,14.69 v16.89,14.41 | v12.26,18.73 12.26,20.7 v12.32,20.77
  Bottom 0.203: v16.89,14.41 16.19,14.41 14.35,16.26 14.35,17.59 13.27,18.67 12.32,18.67 v12.26,18.73 | v12.32,20.77 12.45,20.77 12.81,20.4 17.86,20.4 MS1.27
GND  (via drill 0.39)
  Top 0.178: X3.NC1 7,20.8 6.3,20.1 5.88,20.1 5.78,20.01 5.08,20.01 4.92,19.85 4.92,19.63 3.23,17.94 2.78,17.94 2.75,17.91 1.91,17.91 1.78,18.03 1.78,17.28 D2.C
  Top 0.203: U3.2 15.14,11 | MDBT1.1 MDBT1.2 45.2,15.48 44.83,15.11 44.9,15.05 44.9,8.64 45.25,8.29 45.92,8.29 46.3,7.91 MDBT1.55 | v40.32,19.49 40.32,18.83 R5.2
  Top 0.305: C8.1 30.54,10.53 C4.1 | SW2.A 32.4,7.25 32.71,6.94
  other vias: 11.56,7.49 19.88,5.33 16.89,9.02 31.37,12.95 19.49,17.78 26.16,14.99 28.32,20.19 22.42,20.26 34.35,15.75 42.99,5.65 34.42,6.67 29.91,6.35 29.08,8.83 24.57,11.24 44.7,10.92 44.7,12.57 44.7,14.48 43.31,15.18 43.12,13.72 43.05,12.26 42.93,9.78 43.05,11.11 44.89,8.95 4.89,3.75 7.05,5.33 28.07,6.16 35.5,20.51 11.81,5.84 31.31,8.19
  pour Top: 0,0 45.09,0 45.09,22.86 0,22.86
  pour Bottom: 0,0 45.09,0 45.09,22.86 0,22.86
LED1  (via drill 0.39)
  Top 0.203: v32.96,19.95 33.07,19.84 33.74,19.84 33.93,19.65 37.9,19.65 38.91,18.64 38.91,17.74 39.14,17.5 39.91,17.5 41.09,16.32 41.09,16.09 41.1,16.08 MDBT1.8 | v5.71,22.1 5.75,22.06 5.75,20.97 R2.1
  Bottom 0.203: v32.96,19.95 32.96,19.9 32.51,19.46 8.36,19.46 v5.71,22.1
LED2
  Top 0.203: MDBT1.3 44.4,17.59 45.06,18.25 D4.A
MISO
  Top 0.203: MDBT1.39 38.54,6.53 38.54,2.98 MS1.13
MOSI
  Top 0.203: MS1.12 34.04,1.52 35.4,1.52 36.34,2.46 37.45,2.46 37.99,3.01 MDBT1.37
N$1
  Top 0.203: R3.1 5.87,5.64 D3.C
N$5
  Top 0.203: D2.A 3.76,17.27 R2.2
N$7
  Top 0.203: MDBT1.17 34.44,14.63 33.07,16 31.67,16 30.48,17.2 30.48,17.4 | C1.1 30.16,17.71 30.48,17.4 | 30.48,17.4 Y2.P$1
N$8
  Top 0.203: MDBT1.18 34.63,13.83 32.87,15.58 31.52,15.58 31.09,16.01 29.66,16.01 29.27,16.4 29.08,16.4 Y2.P$2 27.11,18.36 C2.1
N$11  (via drill 0.39)
  Top 0.203: v6.35,9.53 6.82,9.05 6.82,8.29 R3.2 | v14.48,6.6 15.11,7.24 15.11,8.64 16.09,9.61 U3.1
  Bottom 0.203: v14.48,6.6 14.35,6.73 9.14,6.73 v6.35,9.53
N$12
  Top 0.203: U3.5 16.09,7.06 14.47,5.44 R4.1
N$14
  Top 0.203: R5.1 42.94,18.34 D4.C
NEO_PWR  (via drill 0.39)
  Top 0.203: MDBT1.7 41.59,15.09 41.11,14.6 41.02,14.6 40.39,13.97 40.39,12.84 41.19,12.03 41.19,11.47 40.79,11.07 40.23,11.07 39.94,11.36 39.09,11.36 37.59,9.87 v37.59,9.34 | LED1.2 25.45,7.02 v25.53,7.09
  Bottom 0.203: v37.59,9.34 36.77,9.34 36.38,8.94 34.14,8.94 33.01,7.81 32.43,7.81 32.05,7.43 26.1,7.43 25.76,7.09 v25.53,7.09
NEOPIX  (via drill 0.39)
  Top 0.203: MDBT1.38 38.4,7.88 37.72,8.55 v36.96,8.55 | v26.42,6.29 26.3,6.41 23.36,6.41 22.22,5.27 LED1.1
  Bottom 0.203: v36.96,8.55 34.3,8.55 33.17,7.43 32.58,7.43 32.2,7.05 26.74,7.05 26.2,6.51 v26.42,6.29
NFC2  (via drill 0.39)
  Top 0.203: MDBT1.52 44.8,7.84 44.17,8.47 44.17,9.74 v43.94,9.97
  Bottom 0.203: TP1.TP v43.94,9.97
QSPI_CS
  Top 0.203: MDBT1.44 40.91,6.49 40.91,4.62 41.4,4.13 IC2.1
QSPI_DATA0
  Top 0.203: MDBT1.41 39.59,5.72 IC2.5
QSPI_DATA1
  Top 0.203: MDBT1.46 41.99,6.62 41.32,5.95 41.32,4.82 41.51,4.63 IC2.2
QSPI_DATA2  (via drill 0.39)
  Top 0.203: MDBT1.45 41.59,7.81 40.82,8.58 v40.01,8.58 | v42.95,4.32 42.95,4.64 42.46,5.13 IC2.3
  Bottom 0.203: v40.01,8.58 41.27,7.31 41.27,5.93 42.89,4.32 v42.95,4.32
QSPI_DATA3
  Top 0.203: MDBT1.43 40.8,7.31 40.53,7.04 40.53,5.27 39.88,4.63 IC2.7
QSPI_SCK
  Top 0.203: MDBT1.42 39.99,7.31 40.15,7.16 40.15,5.44 39.84,5.13 IC2.6
RESET  (via drill 0.39)
  Top 0.203: MDBT1.40 39.2,8.49 v39,8.69 | SW1.B' 9.43,5.04 v10.79,5.04 12.77,5.04 SW1.B 13.15,4.76 13.92,3.99 24,3.99 24.89,4.88 v24.89,5.33 | v24.64,8.32 24.96,8.32 25.53,8.89 X2.10 28.12,8.89 28.51,9.28 28.51,10.29 28.7,10.48 v28.7,10.87
  Bottom 0.203: MS1.1 10.12,5.04 v10.79,5.04 | v24.89,5.33 24.26,5.97 24.26,7.94 v24.64,8.32 | v28.7,10.87 29.11,10.45 38.31,10.45 38.67,10.1 38.67,9.28 39,8.95 v39,8.69
RXD
  Top 0.203: MS1.14 40.56,2.46 42.27,2.46 43.72,3.91 43.72,5.94 43.47,6.19 43.47,6.47 43.15,6.78 MDBT1.48
SCK  (via drill 0.39)
  Top 0.203: MDBT1.36 37.53,7.75 v36.32,7.75
  Bottom 0.203: v36.32,7.75 34.1,7.75 33.34,6.99 32.77,6.99 32.19,6.41 32.19,1.71 MS1.11
SCL  (via drill 0.39)
  Top 0.203: MDBT1.27 36.42,10.23 37.44,11.25 37.86,11.25 38.85,12.24 39.5,12.24 v39.69,12.43
  Bottom 0.203: MS1.18 41.91,15.09 40.45,13.63 40.45,13.22 40.02,12.79 40.02,12.76 v39.69,12.43
SDA  (via drill 0.39)
  Top 0.203: MDBT1.29 36.61,9.43 38.94,11.75 39.98,11.75 39.97,11.75 v40.51,11.75
  Bottom 0.203: MS1.17 42.42,19.56 42.42,15.05 40.83,13.46 40.83,13.06 40.46,12.69 40.46,11.8 v40.51,11.75
SWCLK  (via drill 0.39)
  Top 0.203: v28.77,12.39 28.7,12.39 28.4,12.7 X2.4 | MDBT1.53 45.2,6.02 45.7,5.51 45.7,4.15 v44.89,3.34
  Bottom 0.203: v28.77,12.39 29.72,12.39 30.9,11.22 38.7,11.22 39.65,10.26 39.71,10.26 40.32,9.65 SWC.TP 40.63,9.7 40.64,9.7 40.66,9.73 40.74,9.64 40.74,8.47 40.77,8.47 41.87,7.38 42.34,7.38 44.19,5.53 44.19,4.04 v44.89,3.34
SWDIO  (via drill 0.39)
  Top 0.203: MDBT1.51 44.65,6.53 44.65,5.96 44.96,5.65 v44.96,4.57 | X2.2 26.69,14.1 28,14.1 v28.7,13.4
  Bottom 0.203: v28.7,13.4 29.34,13.4 31.11,11.62 38.9,11.62 39.96,10.55 41.03,10.55 41.66,9.93 41.66,9.02 41.94,8.74 SWD.TP 41.94,8.36 44.96,5.34 v44.96,4.57
SWITCH  (via drill 0.39)
  Top 0.203: v33.53,5.33 32.02,5.33 SW2.B 31.63,5.02 28.13,5.02 28.13,5.13 SW2.B' | v43.31,8.64 43.31,8.56 43.99,7.87 MDBT1.50
  Bottom 0.203: v33.53,5.33 33.9,5.33 36.69,2.54 45.34,2.54 45.79,2.99 45.79,5.26 43.31,7.75 v43.31,8.64
SWO  (via drill 0.39)
  Top 0.203: MDBT1.47 42.4,7.81 40.8,9.4 39.36,9.4 v39.36,9.64 | v29.4,11.56 29.4,11.68 29.34,11.62 27,11.62 X2.6
  Bottom 0.203: v29.4,11.56 29.4,11.49 30.06,10.84 38.49,10.84 39.42,9.91 39.42,9.71 v39.36,9.64
TXD
  Top 0.203: MS1.15 41.91,1.52 44.2,3.81 44.2,6.03 43.87,6.36 43.87,6.63 43.2,7.31 MDBT1.49
USBD+
  Top 0.203: MDBT1.35 37.2,5.37 R11.2
USBD-
  Top 0.203: MDBT1.34 36.4,6.53 35.95,6.08 35.19,6.08 34.86,5.75 R10.2
VBAT  (via drill 0.39)
  Top 0.406: U3.3 14.19,12.33 C9.2 14.24,13.67 v14.35,13.78 | Q3.3 9.85,10.55 10.92,11.62 10.92,13.46 11.79,14.34 X3.2 11.78,15.55 v12.99,16.76 13.11,16.89 13.11,18.06 13.6,18.54 15.88,18.54 R12.4 16.07,21.15 MS1.28
  Bottom 0.406: v14.35,13.78 12.99,15.14 v12.99,16.76
VBUS  (via drill 0.39)
  Top 0.254: D1.A 7.9,12.39 7.57,12.73 | X1.VBUS 4.79,12.73 4.74,12.67 3.96,12.67 3.3,13.34 1.52,13.34 0.99,12.8 0.99,9.34 0.76,9.11 0.76,5.91 D3.A | MS1.26 21.59,21.52
  Top 0.305: MS1.26 22.35,21.59 23.18,20.77 23.18,16.32 24.51,14.99 v24.7,14.99 | MDBT1.32 33.08,7.43 32.07,8.45 v32.07,8.89
  Top 0.406: 7.57,12.73 X1.VBUS | 21.59,21.52 20.89,20.83 C6.2 20.38,18.73 19.05,18.73 R12.1 | U3.4 14.19,9.14 v14.29,9.14 | v9.46,20.26 9.46,18.73 8.38,17.65 8.38,12.43 | Q3.1 8.8,8.61 8.8,9.5 8.32,9.99 v8.32,10.99 8.32,12.49 8.38,12.43 | D1.A 8.38,12.43
  Bottom 0.254: v9.46,20.26 9.79,19.93 19.18,19.93 20.84,21.59 MS1.26
  Bottom 0.305: v24.7,14.99 25.02,14.99 26.48,13.53 26.48,10.48 27.37,9.59 31.43,9.59 32.07,8.95 v32.07,8.89
  Bottom 0.406: v14.29,9.14 14.29,9.08 12.57,10.79 8.51,10.79 v8.32,10.99
VDIV  (via drill 0.39)
  Top 0.203: v33.53,19.05 34.54,19.05 34.73,19.24 37.73,19.24 38.5,18.47 38.5,17.56 38.97,17.09 39.7,17.09 40.4,16.4 MDBT1.10 | R12.6 R12.5 15.48,16.65 v15.11,17.02
  Bottom 0.203: v15.11,17.02 16.83,17.02 18.86,19.05 v33.53,19.05
VHI
  Top 0.406: 12.18,10.91 12.11,10.99 D1.C 12.11,12.52 12.83,13.24 12.83,14.8 13.27,15.24 16.82,15.24 17.71,16.14 | 12.18,10.91 C7.2 | Q3.2 10.77,9.5 12.18,10.91 | R12.7 17.77,16.2 17.71,16.14 | U2.1 19.92,15.26 19.43,15.75 18.1,15.75 17.71,16.14